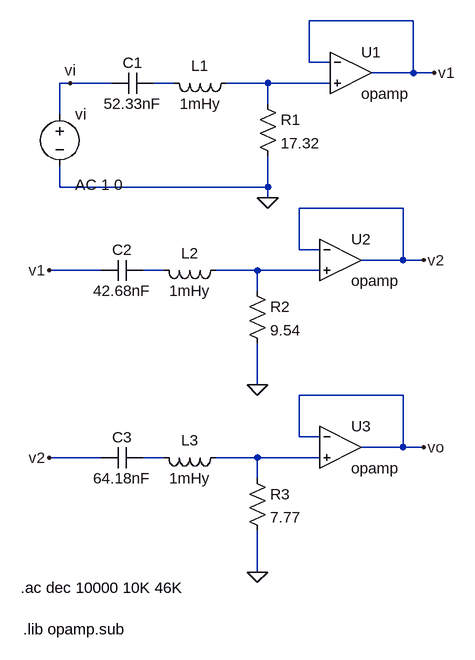
[diagram p0: schematic passive.asc]
passive.asc, the LTspice schematic file:
Version 4
SHEET 1 880 936
WIRE 512 -16 352 -16
WIRE 352 48 352 -16
WIRE 384 48 352 48
WIRE 512 64 512 -16
WIRE 512 64 448 64
WIRE 544 64 512 64
WIRE -16 80 -32 80
WIRE 48 80 -16 80
WIRE 144 80 112 80
WIRE 288 80 224 80
WIRE 384 80 288 80
WIRE 288 112 288 80
WIRE -32 128 -32 80
WIRE -32 240 -32 208
WIRE 288 240 288 192
WIRE 288 240 -32 240
WIRE 288 256 288 240
WIRE 496 272 336 272
WIRE 336 336 336 272
WIRE 368 336 336 336
WIRE 496 352 496 272
WIRE 496 352 432 352
WIRE 528 352 496 352
WIRE 32 368 -48 368
WIRE 128 368 96 368
WIRE 272 368 208 368
WIRE 368 368 272 368
WIRE 272 400 272 368
WIRE 272 544 272 480
WIRE 496 560 336 560
WIRE 336 624 336 560
WIRE 368 624 336 624
WIRE 496 640 496 560
WIRE 496 640 432 640
WIRE 528 640 496 640
WIRE 32 656 -48 656
WIRE 128 656 96 656
WIRE 272 656 208 656
WIRE 368 656 272 656
WIRE 272 688 272 656
WIRE 272 832 272 768
FLAG 288 256 0
FLAG 544 64 v1
FLAG 272 544 0
FLAG 528 352 v2
FLAG 272 832 0
FLAG 528 640 vo
FLAG -48 368 v1
FLAG -48 656 v2
FLAG -16 80 vi
SYMBOL voltage -32 112 R0
WINDOW 123 24 124 Left 2
WINDOW 39 0 0 Left 0
SYMATTR InstName vi
SYMATTR Value ""
SYMATTR Value2 AC 1 0
SYMBOL cap 112 64 R90
WINDOW 0 0 32 VBottom 2
WINDOW 3 32 32 VTop 2
SYMATTR InstName C1
SYMATTR Value 52.33nF
SYMBOL ind 240 64 R90
WINDOW 0 5 56 VBottom 2
WINDOW 3 32 56 VTop 2
SYMATTR InstName L1
SYMATTR Value 1mHy
SYMBOL res 272 96 R0
SYMATTR InstName R1
SYMATTR Value 17.32
SYMBOL OpAmps\\opamp 416 0 R0
SYMATTR InstName U1
SYMBOL cap 96 352 R90
WINDOW 0 0 32 VBottom 2
WINDOW 3 32 32 VTop 2
SYMATTR InstName C2
SYMATTR Value 42.68nF
SYMBOL ind 224 352 R90
WINDOW 0 5 56 VBottom 2
WINDOW 3 32 56 VTop 2
SYMATTR InstName L2
SYMATTR Value 1mHy
SYMBOL res 256 384 R0
SYMATTR InstName R2
SYMATTR Value 9.54
SYMBOL OpAmps\\opamp 400 288 R0
SYMATTR InstName U2
SYMBOL cap 96 640 R90
WINDOW 0 0 32 VBottom 2
WINDOW 3 32 32 VTop 2
SYMATTR InstName C3
SYMATTR Value 64.18nF
SYMBOL ind 224 640 R90
WINDOW 0 5 56 VBottom 2
WINDOW 3 32 56 VTop 2
SYMATTR InstName L3
SYMATTR Value 1mHy
SYMBOL res 256 672 R0
SYMATTR InstName R3
SYMATTR Value 7.77
SYMBOL OpAmps\\opamp 400 576 R0
SYMATTR InstName U3
TEXT -92 856 Left 2 !.ac dec 10000 10K 46K
TEXT -88 920 Left 2 !.lib opamp.sub

The netlist it stands for:
* passive.asc
vi vi 0 AC 1 0
C1 N001 vi 52.33nF
L1 N002 N001 1mHy
R1 N002 0 17.32
XU1 v1 N002 v1 opamp Aol=100K GBW=10Meg  ; pins invin noninvin out
C2 N003 v1 42.68nF
L2 N004 N003 1mHy
R2 N004 0 9.54
XU2 v2 N004 v2 opamp Aol=100K GBW=10Meg  ; pins invin noninvin out
C3 N005 v2 64.18nF
L3 N006 N005 1mHy
R3 N006 0 7.77
XU3 vo N006 vo opamp Aol=100K GBW=10Meg  ; pins invin noninvin out
.ac dec 10000 10K 46K
.lib opamp.sub
.backanno
.end